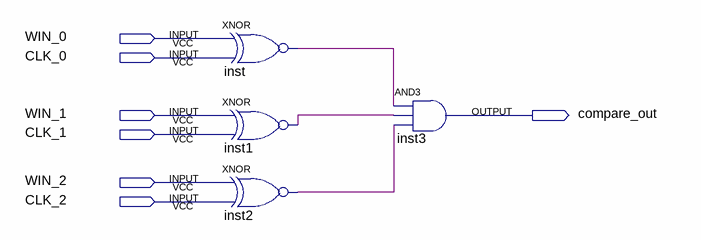
[diagram p0: schematic sheet]
// Quartus schematic threecompare.bdf as structural Verilog: 4 symbols, 7 pins
module threecompare (
  input  WIN_0,
  input  CLK_0,
  input  WIN_1,
  input  CLK_1,
  input  WIN_2,
  input  CLK_2,
  output compare_out
);

  wire inst1_out, inst2_out, inst_out;

  xnor inst (inst_out, WIN_0, CLK_0);
  xnor inst1 (inst1_out, WIN_1, CLK_1);
  xnor inst2 (inst2_out, WIN_2, CLK_2);
  and inst3 (compare_out, inst_out, inst1_out, inst2_out);
endmodule
